# Altium schematic sheet obc-v2_EXP-I2C-IRQ.SchDoc
size 420 x 297 mm; SheetNumber: 13; SheetTotal: 23
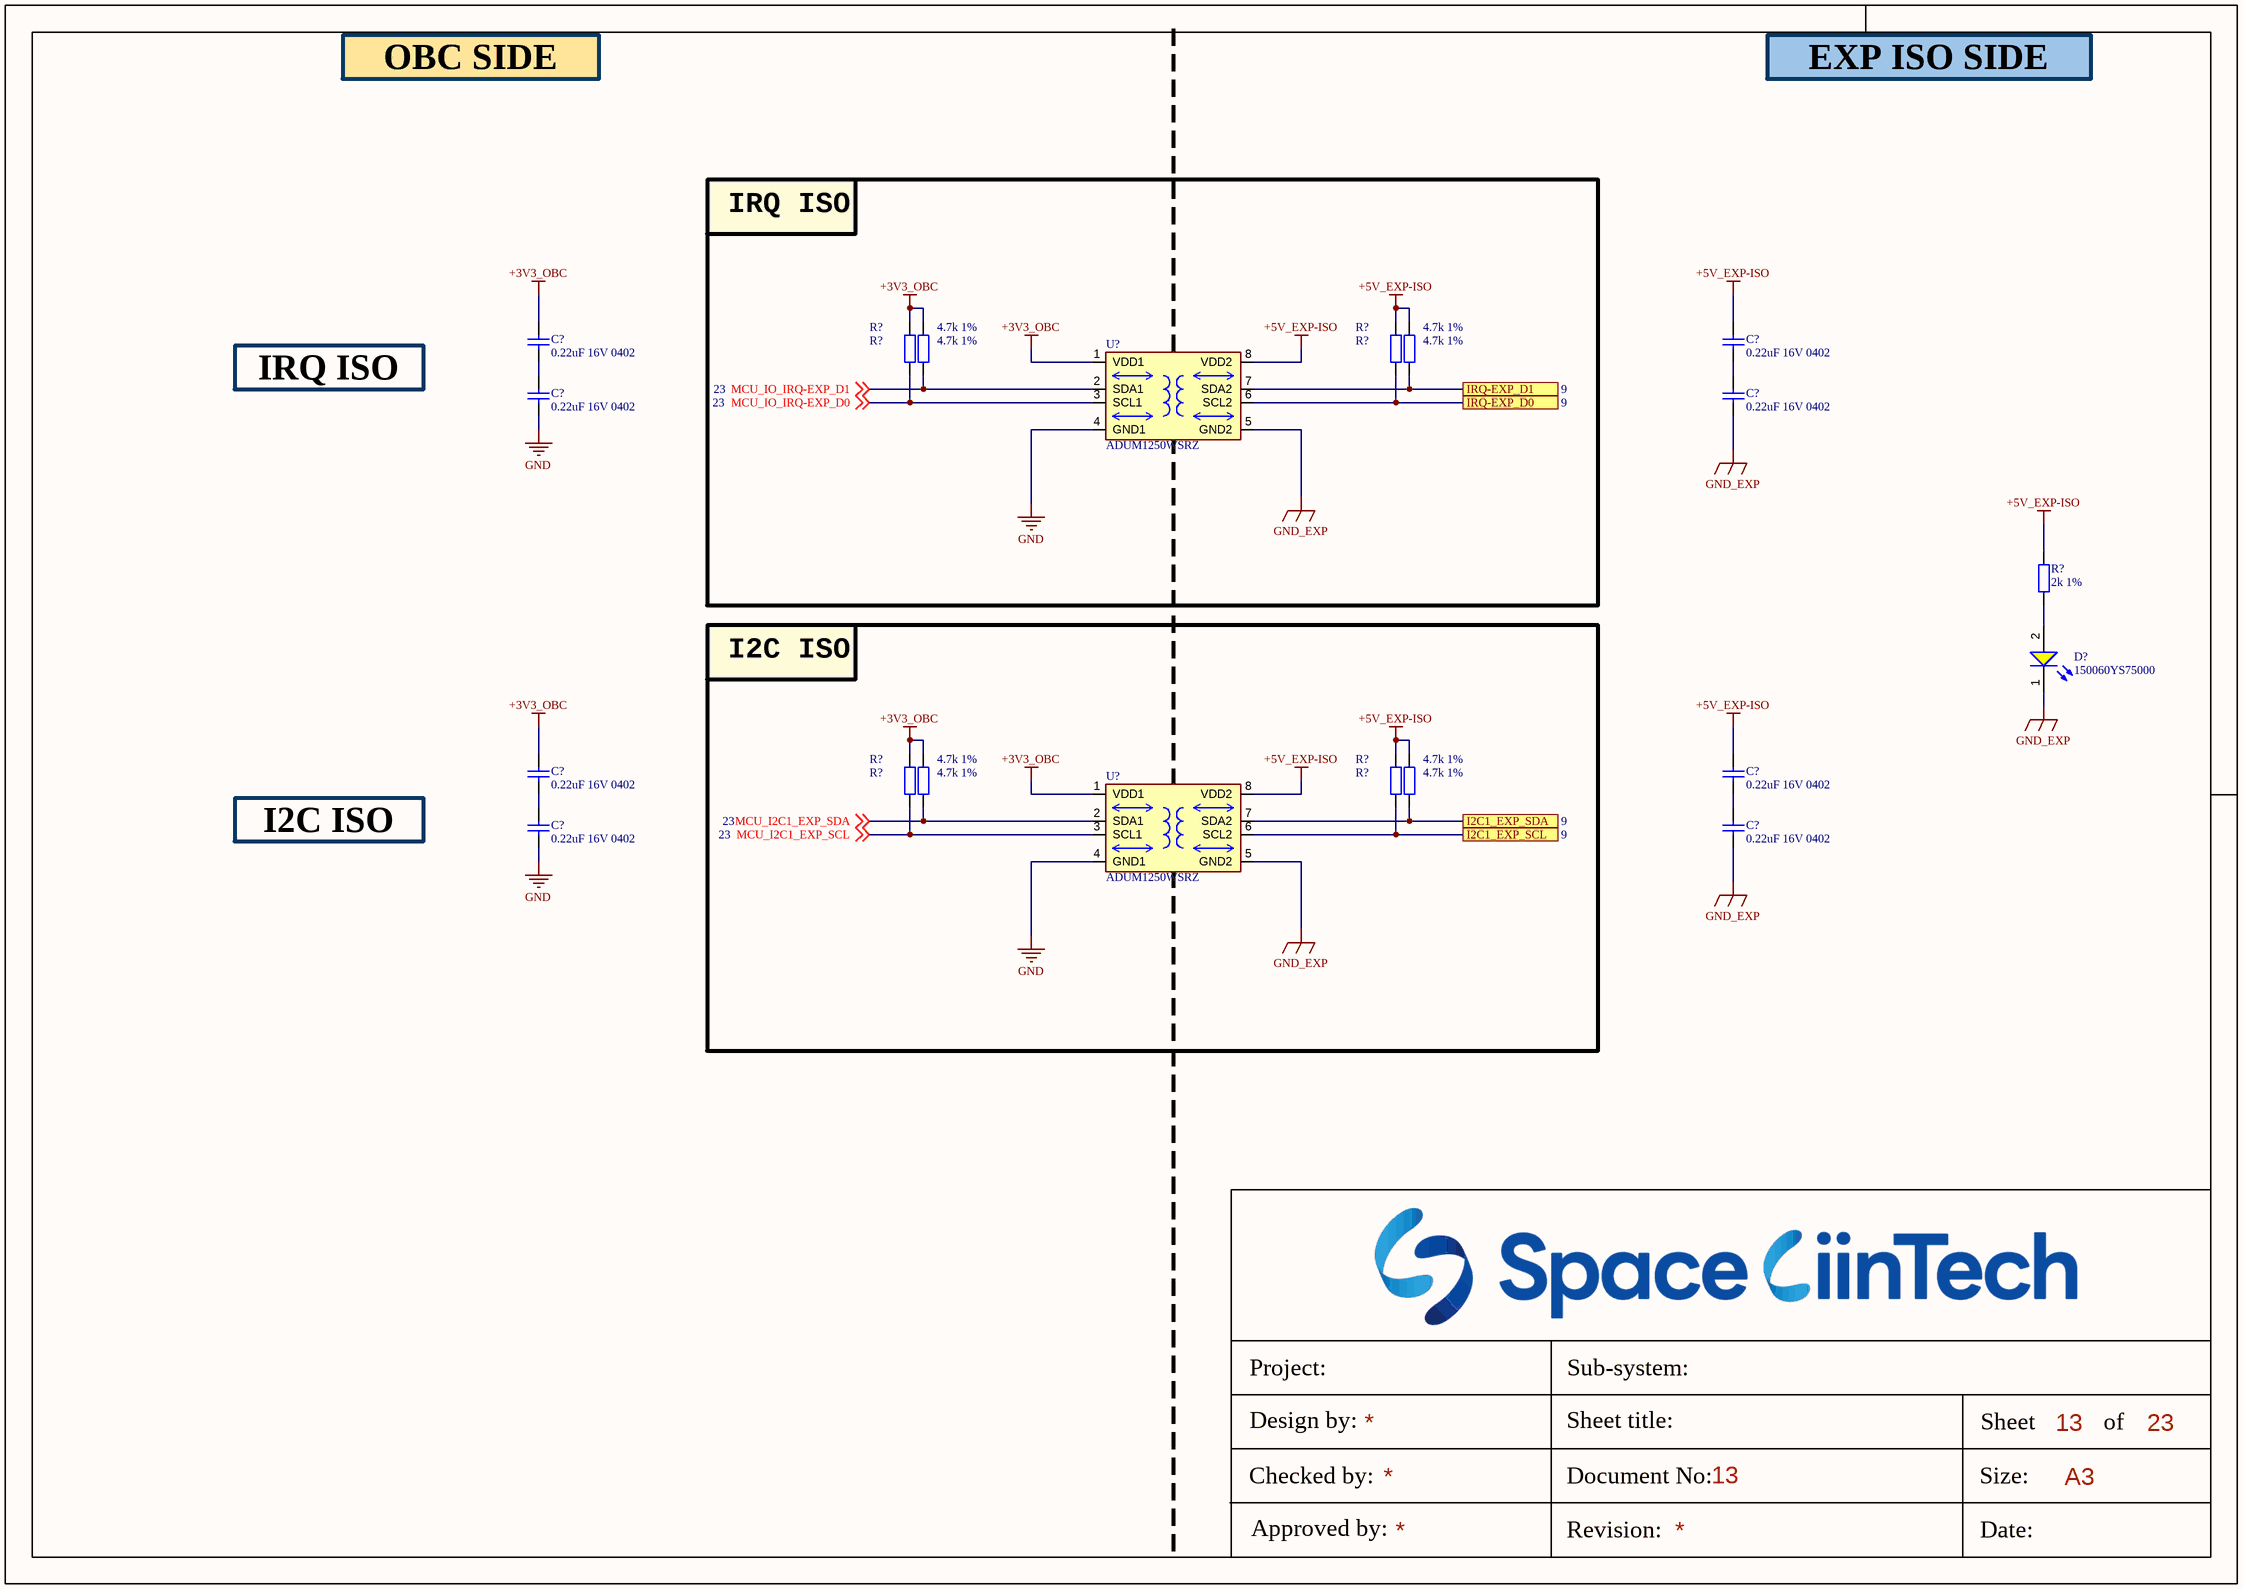
[diagram p0: obc-v2_EXP-I2C-IRQ.SchDoc]

## Parts
(Parts that share a designator on the sheet are numbered #1, #2 ... from top to bottom, then left to right.)
C?#1  0.22uF 16V 0402  [tu 0402]
C?#2  0.22uF 16V 0402  [tu 0402]
C?#3  0.22uF 16V 0402  [tu 0402]
C?#4  0.22uF 16V 0402  [tu 0402]
C?#5  0.22uF 16V 0402  [tu 0402]
C?#6  0.22uF 16V 0402  [tu 0402]
C?#7  0.22uF 16V 0402  [tu 0402]
C?#8  0.22uF 16V 0402  [tu 0402]
D?  150060YS75000  [WL-SMCW_0603_150060xx75000]
R?#1  4.7k 1%  [tro smd 0603]
R?#2  4.7k 1%  [tro smd 0603]
R?#3  4.7k 1%  [tro smd 0603]
R?#4  4.7k 1%  [tro smd 0603]
R?#5  2k 1%  [tro smd 0603]
R?#6  4.7k 1%  [tro smd 0603]
R?#7  4.7k 1%  [tro smd 0603]
R?#8  4.7k 1%  [tro smd 0603]
R?#9  4.7k 1%  [tro smd 0603]
U?#1  ADUM1250WSRZ  [SO8-COOL]
U?#2  ADUM1250WSRZ  [SO8-COOL]

## Blocks framed on the sheet
IRQ ISO: R?#1-R?#4 U?#1
I2C ISO: R?#6-R?#9 U?#2

## Ports
I2C1_EXP_SCL (see 9), I2C1_EXP_SDA (see 9), IRQ-EXP_D0 (see 9), IRQ-EXP_D1 (see 9)

## Nets
+3V3_OBC: C?#1.1 C?#5.1 R?#1.2 R?#2.2 R?#6.2 R?#7.2 U?#1.1(VDD1) U?#2.1(VDD1)
+5V_EXP-ISO: C?#2.1 C?#6.1 R?#3.2 R?#4.2 R?#5.2 R?#8.2 R?#9.2 U?#1.8(VDD2) U?#2.8(VDD2)
GND: C?#3.2 C?#7.2 U?#1.4(GND1) U?#2.4(GND1)
GND_EXP: C?#4.2 C?#8.2 D?.1(K) U?#1.5(GND2) U?#2.5(GND2)
I2C1_EXP_SCL: R?#8.1 U?#2.6(SCL2) ; port I2C1_EXP_SCL
I2C1_EXP_SDA: R?#9.1 U?#2.7(SDA2) ; port I2C1_EXP_SDA
IRQ-EXP_D0: R?#3.1 U?#1.6(SCL2) ; port IRQ-EXP_D0
IRQ-EXP_D1: R?#4.1 U?#1.7(SDA2) ; port IRQ-EXP_D1
MCU_I2C1_EXP_SCL: R?#6.1 U?#2.3(SCL1) ; off-sheet MCU_I2C1_EXP_SCL
MCU_I2C1_EXP_SDA: R?#7.1 U?#2.2(SDA1) ; off-sheet MCU_I2C1_EXP_SDA
MCU_IO_IRQ-EXP_D0: R?#1.1 U?#1.3(SCL1) ; off-sheet MCU_IO_IRQ-EXP_D0
MCU_IO_IRQ-EXP_D1: R?#2.1 U?#1.2(SDA1) ; off-sheet MCU_IO_IRQ-EXP_D1
NetC?#1_2: C?#1.2 C?#3.1
NetC?#2_2: C?#2.2 C?#4.1
NetC?#5_2: C?#5.2 C?#7.1
NetC?#6_2: C?#6.2 C?#8.1
NetD?_2: D?.2(A) R?#5.1

## Notes on the sheet
- OBC SIDE
- EXP ISO SIDE
- IRQ ISO
- I2C ISO
- Project:
- Sub-system:
- Design by:
- Sheet title:
- Sheet
- A3
- of
- Checked by:
- Approved by:
- Revision:
- Document No:
- Size:
- Date:

## Library data of the parts
C?#1-C?#8 = Tu 0402 33nF 10V: 0.22 µF ±10% 16V Ceramic Capacitor X7R 0402 (1005 Metric): GCM155R71C224KE02D; Chung_Loai: Dán; Don_Vi: Con; So_Chan: 2; Ten_Linh_Kien: Tụ 0402 33nF X7R 10V GRM155R71A333KA01D; Ma_Hang: MH007853; Kieu_Chan: *
D? = CMP-1426-00005-2: LED YELLOW CLEAR 0603 SMD; NexarPartId: 29687085; Wavelength: 590nm; Luminous Intensity: 120mcd; Peak Wavelength: 595nm; Forward Current: 100mA; Power Dissipation: 72mW; Forward Voltage: 2V; Test Current: 20mA; Reverse Voltage: 5V; Lens Style: Clear, Rectangular; Max Junction Temperature (Tj): 95°C; Viewing Angle: 140°; Case Code (Imperial): 0603; Height: 700µm; REACH SVHC: Unknown; Dominant Wavelength: 590nm; Min Operating Temperature: -40°C; Color: Yellow; Width: 800µm; Mount: Surface Mount; Packaging: Tape and Reel; Max Operating Temperature: 85°C; RoHS: Compliant; Max Reverse Voltage (DC): 5V; Case Code (Metric): 1608; Length: 1.6mm; Case/Package: 0603
R?#1-R?#4 R?#6-R?#9 = Tro 0603 1% 10k: RES 4.7K OHM 1% 1/10W 0603, P/N: ERJ-U03F4701V; Chung_Loai: Dán; Don_Vi: Con; So_Chan: 2; Ten_Linh_Kien: Trở 0603 1% 10k; Ma_Hang: MH006333; Kieu_Chan: *
R?#5 = Tro 0603 1% 10k: RES SMD 2.2K OHM 1% 1/10W 0603, P/N: ERJ-3EKF2201V; Chung_Loai: Dán; Don_Vi: Con; So_Chan: 2; Ten_Linh_Kien: Trở 0603 1% 10k; Ma_Hang: MH006333; Kieu_Chan: *
U?#1 U?#2 = ADUM1250: IÂ²C Digital Isolator 2500Vrms 2 Channel 1Mbps 25kV/Âµs CMTI 8-SOIC (0.154", 3.90mm Width); MF: Analog Devices; Package: SOIC-8; Price: None; Value: *; SnapEDA_Link: https://www.snapeda.com/parts/ADUM1250/Analog+Devices/view-part/?ref=snap; MP: ADUM1250; Availability: Unavailable; Check_prices: https://www.snapeda.com/parts/ADUM1250/Analog+Devices/view-part/?ref=eda